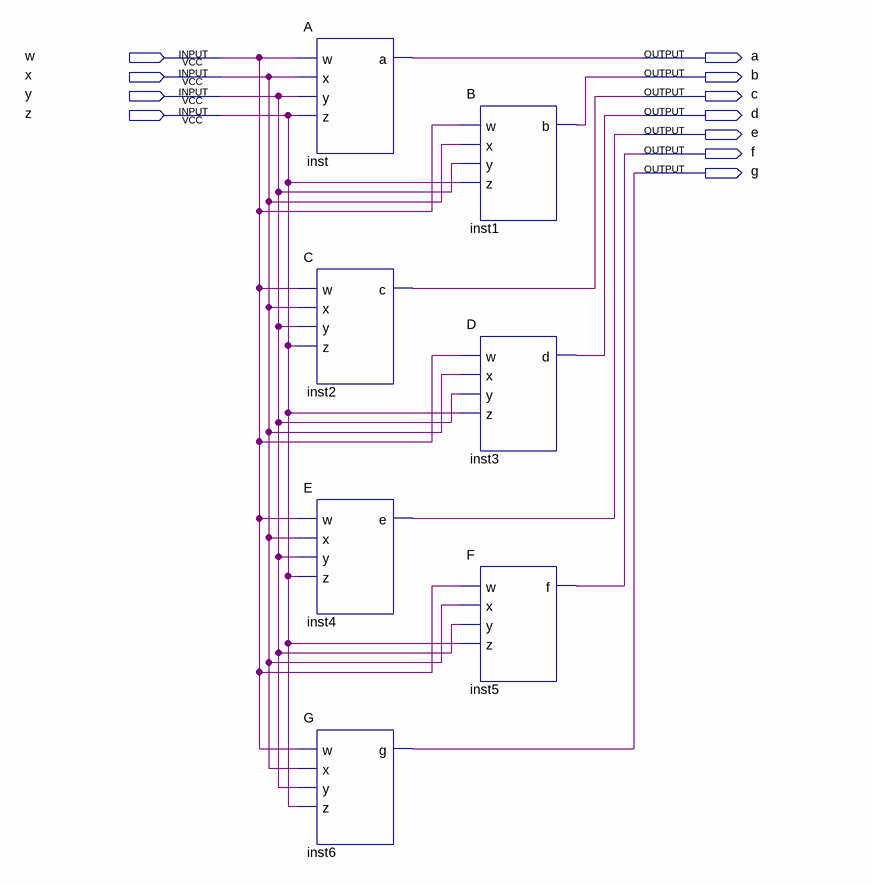
[diagram p0: schematic sheet]
// Quartus schematic 7_SEGMENT_DISPLAY.bdf as structural Verilog: 7 symbols, 11 pins
module \7_SEGMENT_DISPLAY  (
  input  w,
  input  x,
  input  y,
  input  z,
  output a,
  output b,
  output c,
  output d,
  output e,
  output f,
  output g
);

  A inst (.w(w), .x(x), .y(y), .z(z), .a(a));
  C inst2 (.w(w), .x(x), .y(y), .z(z), .c(c));
  E inst4 (.w(w), .x(x), .y(y), .z(z), .e(e));
  G inst6 (.w(w), .x(x), .y(y), .z(z), .g(g));
  B inst1 (.w(w), .x(x), .y(y), .z(z), .b(b));
  D inst3 (.w(w), .x(x), .y(y), .z(z), .d(d));
  F inst5 (.w(w), .x(x), .y(y), .z(z), .f(f));
endmodule
